# Altium schematic sheet sonar.SchDoc
size A4; SheetNumber: 8; SheetTotal: 9
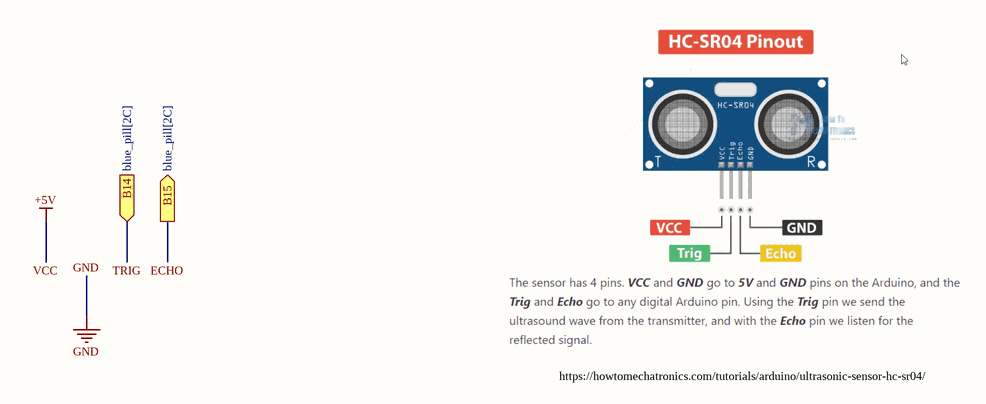
[diagram p0: sonar.SchDoc]

## Ports
B14 (in, see blue_pill[2C]), B15 (out, see blue_pill[2C])

## Nets
ECHO: port B15
TRIG: port B14

## Notes on the sheet
- https://howtomechatronics.com/tutorials/arduino/ultrasonic-sensor-hc-sr04/